# Altium schematic sheet Sheet2.SchDoc
size A; SheetNumber: 1; SheetTotal: 1
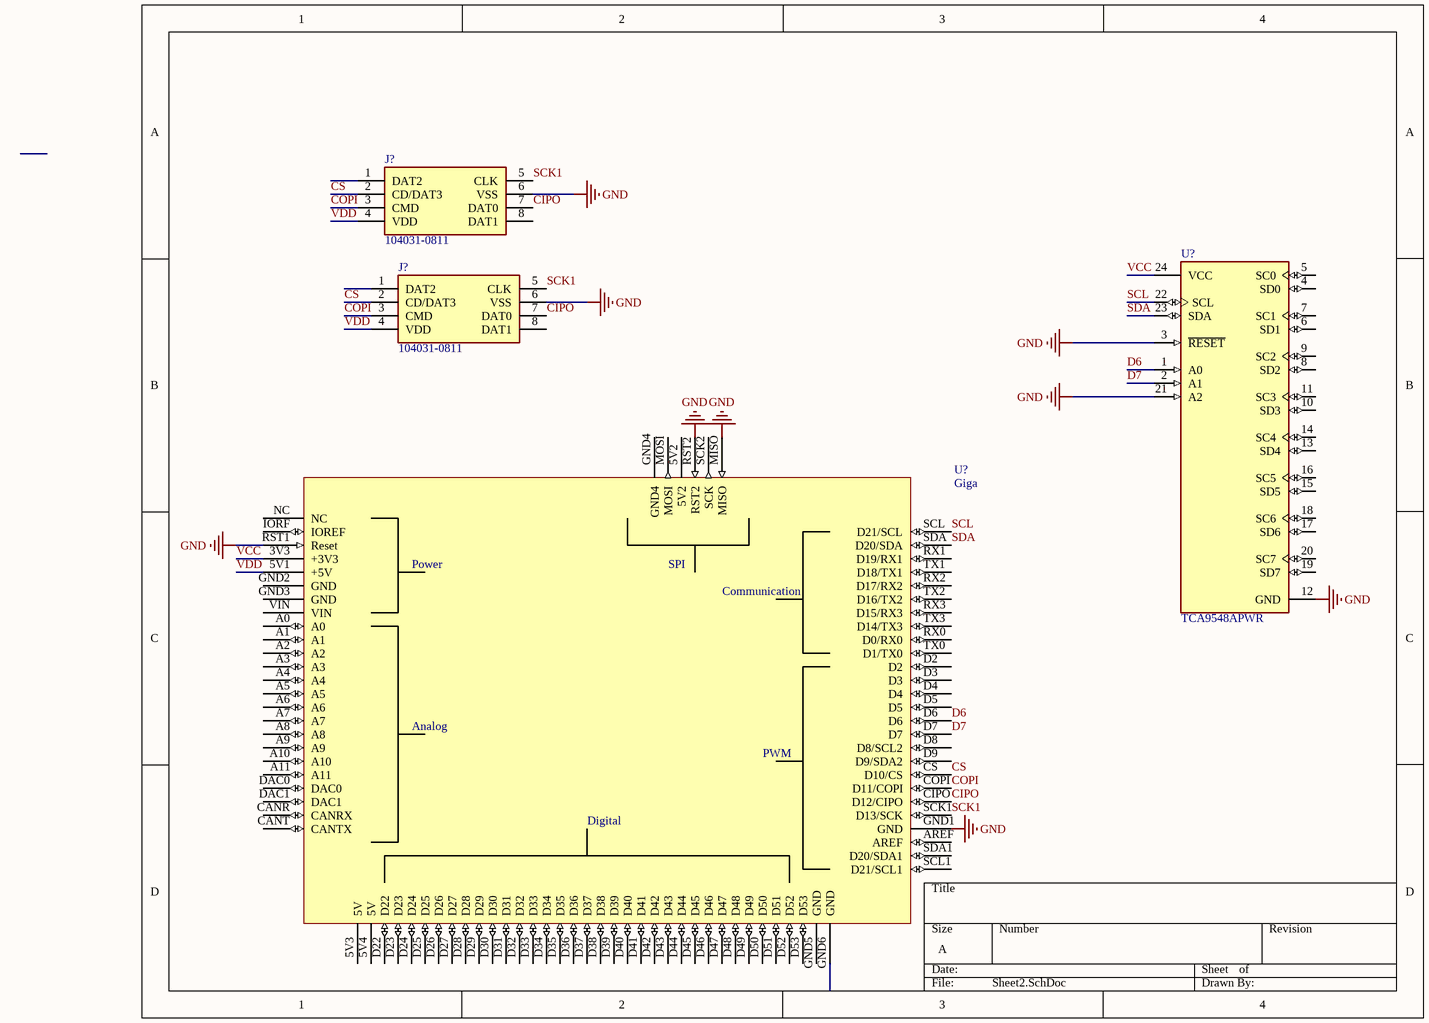
[diagram p0: Sheet2.SchDoc]

## Parts
(Parts that share a designator on the sheet are numbered #1, #2 ... from top to bottom, then left to right.)
J?#1  104031-0811  [1040310811]
J?#2  104031-0811  [1040310811]
U?#1  TCA9548APWR  [FP-PW0024A-MFG]
U?#2  Giga  [Arduino_Giga_R1_WiFi_Shield]

## Nets
GND: J?#1.6(VSS) J?#2.6(VSS) U?#1.3(~{RESET}) U?#1.12(GND) U?#1.21(A2) U?#2.GND1(GND) U?#2.MISO U?#2.RST1(Reset) U?#2.RST2
CIPO: J?#1.7(DAT0) J?#2.7(DAT0) U?#2.CIPO(D12/CIPO)
COPI: J?#1.3(CMD) J?#2.3(CMD) U?#2.COPI(D11/COPI)
CS: J?#1.2(CD/DAT3) J?#2.2(CD/DAT3) U?#2.CS(D10/CS)
D6: U?#1.1(A0) U?#2.D6
D7: U?#1.2(A1) U?#2.D7
SCK1: J?#1.5(CLK) J?#2.5(CLK) U?#2.SCK1(D13/SCK)
SCL: U?#1.22(SCL) U?#2.SCL(D21/SCL)
SDA: U?#1.23(SDA) U?#2.SDA(D20/SDA)
VCC: U?#1.24(VCC) U?#2.3V3(+3V3)
VDD: J?#1.4(VDD) J?#2.4(VDD) U?#2.5V1(+5V)

Not connected (* = marked no-connect by the designer): J?#1 1(DAT2) 8(DAT1); J?#2 1(DAT2) 8(DAT1); U?#1 4(SD0) 5(SC0) 6(SD1) 7(SC1) 8(SD2) 9(SC2) 10(SD3) 11(SC3) 13(SD4) 14(SC4) 15(SD5) 16(SC5) 17(SD6) 18(SC6) 19(SD7) 20(SC7); U?#2 5V2 5V3(5V) 5V4(5V) A0 A1 A2 A3 A4 A5 A6 A7 A8 A9 A10 A11 AREF CANR(CANRX) CANT(CANTX) D2 D3 D4 D5 D8(D8/SCL2) D9(D9/SDA2) D22 D23 D24 D25 D26 D27 D28 D29 D30 D31 D32 D33 D34 D35 D36 D37 D38 D39 D40 D41 D42 D43 D44 D45 D46 D47 D48 D49 D50 D51 D52 D53 DAC0 DAC1 GND2(GND) GND3(GND) GND4 GND5(GND) GND6(GND) IORF(IOREF) MOSI NC RX0(D0/RX0) RX1(D19/RX1) RX2(D17/RX2) RX3(D15/RX3) SCK2(SCK) SCL1(D21/SCL1) SDA1(D20/SDA1) TX0(D1/TX0) TX1(D18/TX1) TX2(D16/TX2) TX3(D14/TX3) VIN

## Notes on the sheet
- (in symbol Component_1) Power; SPI; Communication; Analog; PWM; Digital

## Library data of the parts
J?#1 J?#2 = 104031-0811: Connector; Manufacturer_Name: Molex; Datasheet Link: http://www.molex.com/webdocs/datasheets/pdf/en-us/1040310811_MEMORY_CARD_SOCKET.pdf; Manufacturer_Part_Number: 104031-0811; Mouser Part Number: 538-104031-0811; Mouser Price/Stock: https://www.mouser.co.uk/ProductDetail/Molex/104031-0811?qs=udsGRKD4nA3Tvy7wqky%252BuA%3D%3D
U?#1 = CMP-04892-000002-1: IC I2C SW 8CH W/RESET 24TSSOP; Manufacturer: Texas Instruments; Number Of Circuits: 1; Mux Demux Ratio: 1:8; Nominal Supply Current: 2-50uA; Interface: I2C,SMBus; Min Supply Voltage: 1.65V; Standoff Height: 0.05mm; Max Supply Voltage: 5.5V; Device Class L2: Interface ICs; ComponentLink2Description: Datasheet; Ipc Land Pattern Name: SOP65P640X120-24; Category: IC; Device Class L1: Integrated Circuits (ICs); Manufacturer Part Number: TCA9548APWR; RoHS: TRUE; Temperature Range High: +85°C; Digikey Description: IC I2C SW 8CH W/RESET 24TSSOP; Temperature Range Low: -40°C; Lead Free: Yes; Package: PW0024A; ComponentLink2URL: http://www.ti.com/lit/ds/symlink/tca9548a.pdf; Device Class L3: Multiplexers; Ambient Temperature Range Low: -40°C; Mouser Description: Low-Voltage 8-Channel I2C Switch With Reset 24-TSSOP -40 to 85; Temperature: -40°C to +85°C; Octopart: https://octopart.com/tca9548apwr-texas+instruments-22266789; Ambient Temperature Range High: +85°C; Automotive: No; Height: 1.2mm
U?#2 = Component_1